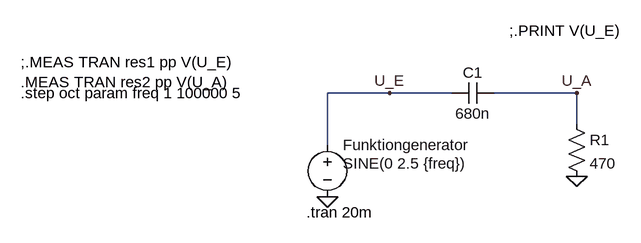
[diagram p0: schematic labor1.asc]
labor1.asc, the LTspice schematic file:
Version 4
SHEET 1 880 680
WIRE -64 32 -160 32
WIRE 32 32 -64 32
WIRE 224 32 96 32
WIRE 224 80 224 32
WIRE -160 112 -160 32
FLAG 224 32 U_A
FLAG -64 32 U_E
FLAG -160 192 0
FLAG 224 160 0
SYMBOL res 208 64 R0
SYMATTR InstName R1
SYMATTR Value 470
SYMBOL cap 96 16 R90
WINDOW 0 0 32 VBottom 2
WINDOW 3 32 32 VTop 2
SYMATTR InstName C1
SYMATTR Value 680n
SYMBOL voltage -160 96 R0
WINDOW 3 24 44 Left 2
WINDOW 123 0 0 Left 0
WINDOW 39 0 0 Left 0
SYMATTR Value SINE(0 2.5 {freq})
SYMATTR InstName Funktiongenerator
TEXT -192 216 Left 2 !.tran 20m
TEXT 120 -64 Left 2 !;.PRINT V(U_E)
TEXT -632 -16 Left 2 !;.MEAS TRAN res1 pp V(U_E)\n.MEAS TRAN res2 pp V(U_A)
TEXT -632 32 Left 2 !.step oct param freq 1 100000 5

The netlist it stands for:
* labor1.asc
R1 U_A 0 470
C1 U_A U_E 680n
V§Funktiongenerator U_E 0 SINE(0 2.5 {freq})
.tran 20m
;.PRINT V(U_E)
;.MEAS TRAN res1 pp V(U_E)
.MEAS TRAN res2 pp V(U_A)
.step oct param freq 1 100000 5
.backanno
.end